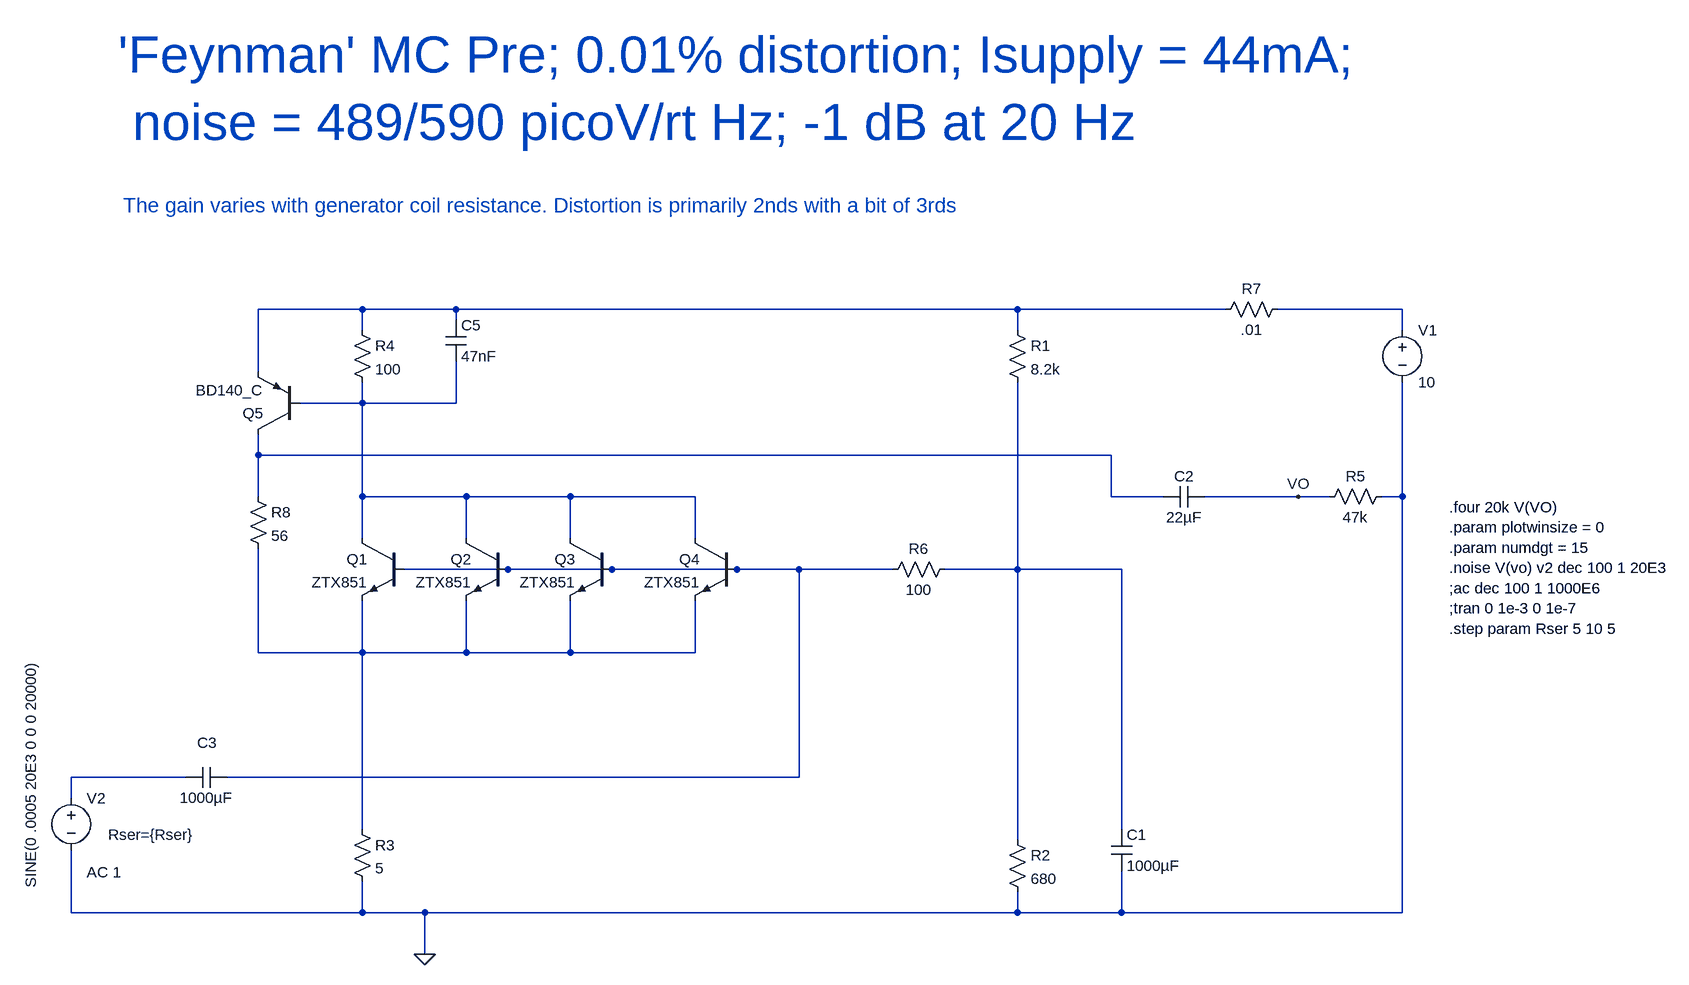
[diagram p0: schematic Feynman.asc]
Feynman.asc, the LTspice schematic file:
Version 4
SHEET 1 2212 712
WIRE -576 -304 -736 -304
WIRE -432 -304 -576 -304
WIRE 432 -304 -432 -304
WIRE 752 -304 432 -304
WIRE 1024 -304 832 -304
WIRE -432 -288 -432 -304
WIRE -576 -272 -576 -304
WIRE 432 -272 432 -304
WIRE 1024 -272 1024 -304
WIRE -736 -208 -736 -304
WIRE -576 -160 -576 -192
WIRE -576 -160 -672 -160
WIRE -432 -160 -432 -224
WIRE -432 -160 -576 -160
WIRE -736 -80 -736 -112
WIRE 576 -80 -736 -80
WIRE -736 -16 -736 -80
WIRE -576 -16 -576 -160
WIRE -416 -16 -576 -16
WIRE -256 -16 -416 -16
WIRE -64 -16 -256 -16
WIRE 576 -16 576 -80
WIRE 656 -16 576 -16
WIRE 864 -16 720 -16
WIRE 912 -16 864 -16
WIRE 1024 -16 1024 -192
WIRE 1024 -16 992 -16
WIRE -576 48 -576 -16
WIRE -416 48 -416 -16
WIRE -256 48 -256 -16
WIRE -64 48 -64 -16
WIRE -352 96 -512 96
WIRE -192 96 -352 96
WIRE 0 96 -192 96
WIRE 96 96 0 96
WIRE 240 96 96 96
WIRE 432 96 432 -192
WIRE 432 96 320 96
WIRE 592 96 432 96
WIRE -736 224 -736 64
WIRE -576 224 -576 144
WIRE -576 224 -736 224
WIRE -416 224 -416 144
WIRE -416 224 -576 224
WIRE -256 224 -256 144
WIRE -256 224 -416 224
WIRE -64 224 -64 144
WIRE -64 224 -256 224
WIRE -848 416 -1024 416
WIRE 96 416 96 96
WIRE 96 416 -784 416
WIRE -1024 448 -1024 416
WIRE -576 496 -576 224
WIRE 592 496 592 96
WIRE 432 512 432 96
WIRE -1024 624 -1024 528
WIRE -576 624 -576 576
WIRE -576 624 -1024 624
WIRE -480 624 -576 624
WIRE 432 624 432 592
WIRE 432 624 -480 624
WIRE 592 624 592 560
WIRE 592 624 432 624
WIRE 1024 624 1024 -16
WIRE 1024 624 592 624
WIRE -480 688 -480 624
FLAG -480 688 0
FLAG 864 -16 VO
SYMBOL voltage 1024 -288 R0
WINDOW 123 0 0 Left 2
WINDOW 39 0 0 Left 2
SYMATTR InstName V1
SYMATTR Value 10
SYMBOL voltage -1024 432 R0
WINDOW 3 -62 -197 VRight 2
WINDOW 123 24 130 Left 2
WINDOW 39 57 72 Left 2
SYMATTR Value SINE(0 .0005 20E3 0 0 0 20000)
SYMATTR Value2 AC 1
SYMATTR SpiceLine Rser={Rser}
SYMATTR InstName V2
SYMBOL npn -512 48 M0
SYMATTR InstName Q1
SYMATTR Value ZTX851
SYMBOL res 416 -288 R0
SYMATTR InstName R1
SYMATTR Value 8.2k
SYMBOL res -592 480 R0
SYMATTR InstName R3
SYMATTR Value 5
SYMBOL cap 576 496 R0
SYMATTR InstName C1
SYMATTR Value 1000µF
SYMBOL res -592 -288 R0
SYMATTR InstName R4
SYMATTR Value 100
SYMBOL cap 720 -32 R90
WINDOW 0 0 32 VBottom 2
WINDOW 3 32 32 VTop 2
SYMATTR InstName C2
SYMATTR Value 22µF
SYMBOL res 1008 -32 R90
WINDOW 0 0 56 VBottom 2
WINDOW 3 32 56 VTop 2
SYMATTR InstName R5
SYMATTR Value 47k
SYMBOL cap -784 400 R90
WINDOW 0 -22 31 VBottom 2
WINDOW 3 32 32 VTop 2
SYMATTR InstName C3
SYMATTR Value 1000µF
SYMBOL npn -352 48 M0
SYMATTR InstName Q2
SYMATTR Value ZTX851
SYMBOL npn -192 48 M0
SYMATTR InstName Q3
SYMATTR Value ZTX851
SYMBOL npn 0 48 M0
SYMATTR InstName Q4
SYMATTR Value ZTX851
SYMBOL res 848 -320 R90
WINDOW 0 0 56 VBottom 2
WINDOW 3 32 56 VTop 2
SYMATTR InstName R7
SYMATTR Value .01
SYMBOL res 416 496 R0
SYMATTR InstName R2
SYMATTR Value 680
SYMBOL pnp -672 -112 R180
SYMATTR InstName Q5
SYMATTR Value BD140_C
SYMBOL res -752 -32 R0
SYMATTR InstName R8
SYMATTR Value 56
SYMBOL res 336 80 R90
WINDOW 0 0 56 VBottom 2
WINDOW 3 32 56 VTop 2
SYMATTR InstName R6
SYMATTR Value 100
SYMBOL cap -448 -288 R0
SYMATTR InstName C5
SYMATTR Value 47nF
TEXT 1096 0 Left 2 !.four 20k V(VO)\n.param plotwinsize = 0\n.param numdgt = 15\n.noise V(vo) v2 dec 100 1 20E3\n;ac dec 100 1 1000E6\n;tran 0 1e-3 0 1e-7\n.step param Rser 5 10 5
TEXT -952 -696 Left 6 ;'Feynman' MC Pre; 0.01% distortion; Isupply = 44mA;\n noise = 489/590 picoV/rt Hz; -1 dB at 20 Hz
TEXT -944 -464 Left 3 ;The gain varies with generator coil resistance. Distortion is primarily 2nds with a bit of 3rds

The netlist it stands for:
* Feynman.asc
V1 N002 0 10
V2 N008 0 SINE(0 .0005 20E3 0 0 0 20000) AC 1 Rser={Rser}
Q1 N003 N005 N007 0 ZTX851
R1 N001 N006 8.2k
R3 N007 0 5
C1 N006 0 1000µF
R4 N001 N003 100
C2 VO N004 22µF
R5 0 VO 47k
C3 N005 N008 1000µF
Q2 N003 N005 N007 0 ZTX851
Q3 N003 N005 N007 0 ZTX851
Q4 N003 N005 N007 0 ZTX851
R7 N002 N001 .01
R2 N006 0 680
Q5 N004 N003 N001 0 BD140_C
R8 N004 N007 56
R6 N006 N005 100
C5 N001 N003 47nF
.model NPN NPN
.model PNP PNP
.lib standard.bjt
.four 20k V(VO)
.param plotwinsize = 0
.param numdgt = 15
.noise V(vo) v2 dec 100 1 20E3
;ac dec 100 1 1000E6
;tran 0 1e-3 0 1e-7
.step param Rser 5 10 5
* 'Feynman' MC Pre; 0.01% distortion; Isupply = 44mA;
*  noise = 489/590 picoV/rt Hz; -1 dB at 20 Hz
* The gain varies with generator coil resistance. Distortion is primarily 2nds with a bit of 3rds
.backanno
.end